# Altium schematic sheet UART.SchDoc
size A3; Author: Nguyễn Hữu Thắng; DrawnBy: Nguyễn Hữu Thắng; SheetNumber: 29; SheetTotal: 35
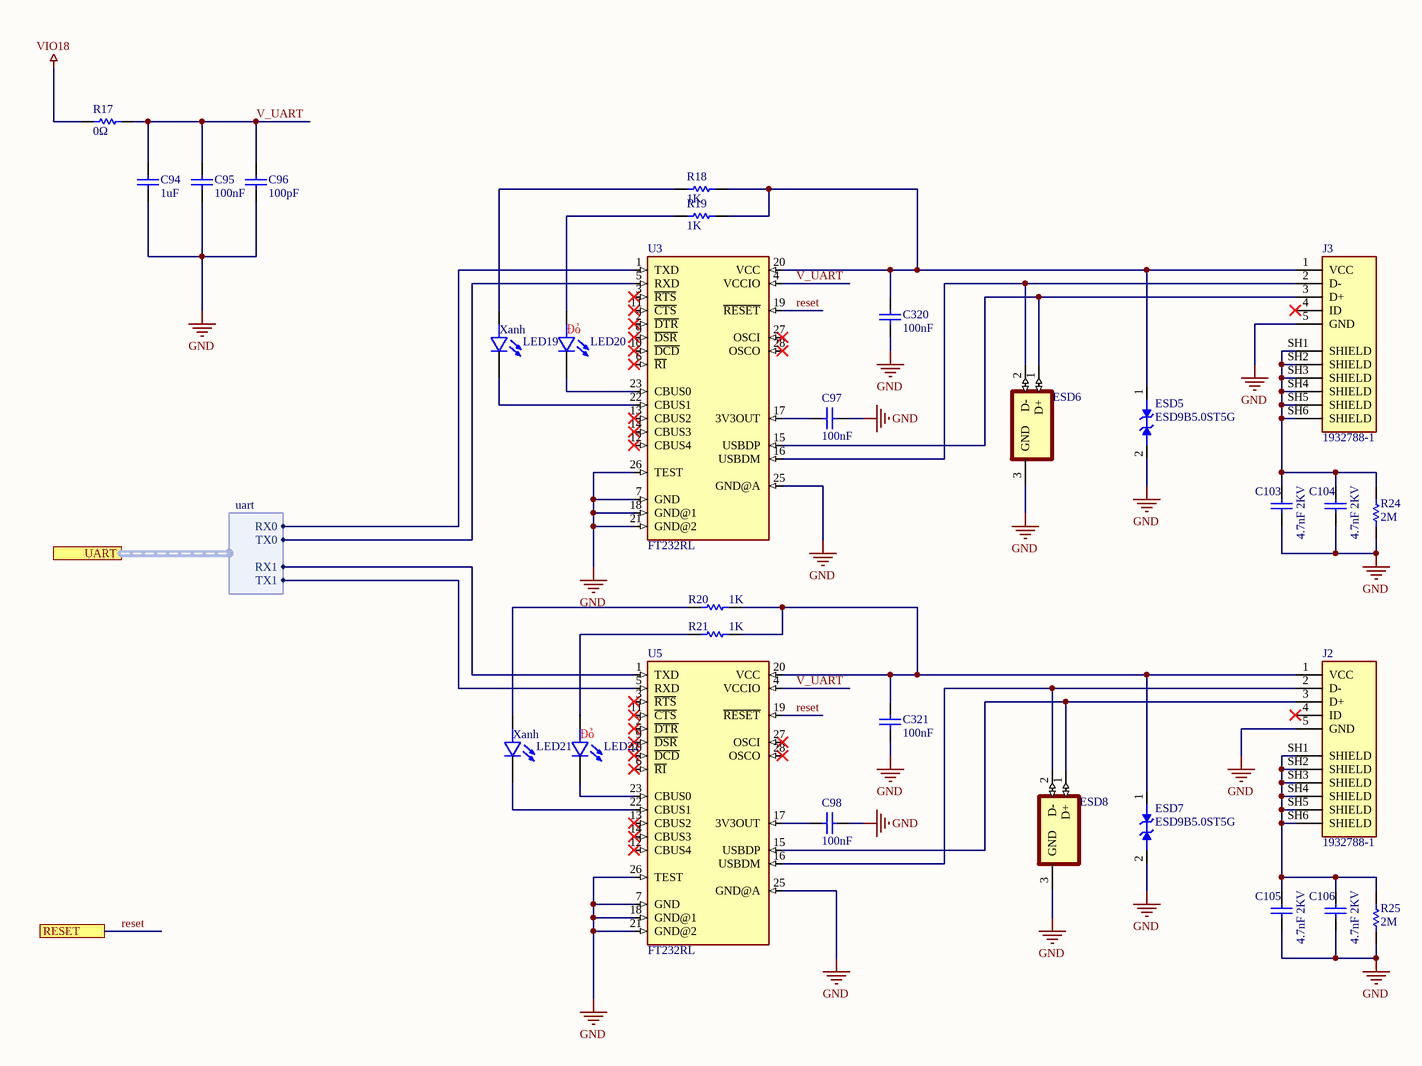
[diagram p0: UART.SchDoc]

## Parts
C94  value 1uF  [C0805]  (hidden comment: C0805)
C95  value 100nF  [C0603]  (hidden comment: C0603)
C96  value 100pF  [C0402]  (hidden comment: C0402)
C97  value 100nF  [C0603]  (hidden comment: C0603)
C98  value 100nF  [C0603]  (hidden comment: C0603)
C103  value 4.7nF 2KV  [C1210]  (hidden comment: C1210)
C104  value 4.7nF 2KV  [C1210]  (hidden comment: C1210)
C105  value 4.7nF 2KV  [C1210]  (hidden comment: C1210)
C106  value 4.7nF 2KV  [C1210]  (hidden comment: C1210)
C320  value 100nF  [C0603]  (hidden comment: C0603)
C321  value 100nF  [C0603]  (hidden comment: C0603)
ESD5  ESD9B5.0ST5G  [SODFL1006X40N]
ESD6  TPD2EUSB30DRTR  [SOTFL35P100X50-3N]  (value not drawn)
ESD7  ESD9B5.0ST5G  [SODFL1006X40N]
ESD8  TPD2EUSB30DRTR  [SOTFL35P100X50-3N]  (value not drawn)
J2  1932788-1  [TE_1932788-1]
J3  1932788-1  [TE_1932788-1]
LED19  LED0402  [LED0402]  (value not drawn)
LED20  LED0402  [LED0402]  (value not drawn)
LED21  LED0402  [LED0402]  (value not drawn)
LED22  LED0402  [LED0402]  (value not drawn)
R17  value 0Ω  [R0603]  (hidden comment: R0603)
R18  value 1K  [R0603]  (hidden comment: R0603)
R19  value 1K  [R0603]  (hidden comment: R0603)
R20  value 1K  [R0603]  (hidden comment: R0603)
R21  value 1K  [R0603]  (hidden comment: R0603)
R24  value 2M  [R0603]  (hidden comment: R0603)
R25  value 2M  [R0603]  (hidden comment: R0603)
U3  FT232RL  [FT232RL]
U5  FT232RL  [FT232RL]

## Ports
RESET (see main[9000,5800], Control_Interface[4100,4800], Power[11300,7100], RTL8201F[12800,5800]), UART (harness uart, see main[9000,5600], MT8365[6300,9000], MT8365_CONN[11800,6800])

## Harnesses
uart: TX0, RX0, TX1, RX1

## Nets
GND: C94.2 C95.1 C96.1 C97.1 C98.1 C103.1 C104.1 C105.1 C106.1 C320.1 C321.1 ESD5.2(A1) ESD6.3(GND) ESD7.2(A1) ESD8.3(GND) J2.5(GND) J3.5(GND) R24.2 R25.2 U3.7(GND) U3.18(GND@1) U3.21(GND@2) U3.25(GND@A) U3.26(TEST) U5.7(GND) U5.18(GND@1) U5.21(GND@2) U5.25(GND@A) U5.26(TEST)
VIO18: R17.1
reset: U3.19(~{RESET}) U5.19(~{RESET}) ; port RESET
V_UART: C94.1 C95.2 C96.2 R17.2 U3.4(VCCIO) U5.4(VCCIO)
NetC97_2: C97.2 U3.17(3V3OUT)
NetC98_2: C98.2 U5.17(3V3OUT)
NetC103_2: C103.2 C104.2 J3.SH1(SHIELD) J3.SH2(SHIELD) J3.SH3(SHIELD) J3.SH4(SHIELD) J3.SH5(SHIELD) J3.SH6(SHIELD) R24.1
NetC105_2: C105.2 C106.2 J2.SH1(SHIELD) J2.SH2(SHIELD) J2.SH3(SHIELD) J2.SH4(SHIELD) J2.SH5(SHIELD) J2.SH6(SHIELD) R25.1
NetC320_2: C320.2 ESD5.1(A) J3.1(VCC) R18.2 R19.2 U3.20(VCC)
NetC321_2: C321.2 ESD7.1(A) J2.1(VCC) R20.2 R21.2 U5.20(VCC)
NetESD6_1: ESD6.1(D+) J3.3(D+) U3.15(USBDP)
NetESD6_2: ESD6.2(D-) J3.2(D-) U3.16(USBDM)
NetESD8_1: ESD8.1(D+) J2.3(D+) U5.15(USBDP)
NetESD8_2: ESD8.2(D-) J2.2(D-) U5.16(USBDM)
NetLED19_A: LED19.A R18.1
NetLED19_C: LED19.C U3.22(CBUS1)
NetLED20_A: LED20.A R19.1
NetLED20_C: LED20.C U3.23(CBUS0)
NetLED21_A: LED21.A R20.1
NetLED21_C: LED21.C U5.22(CBUS1)
NetLED22_A: LED22.A R21.1
NetLED22_C: LED22.C U5.23(CBUS0)
NetU3_1: U3.1(TXD) ; port UART.RX0
NetU3_5: U3.5(RXD) ; port UART.TX0
NetU5_1: U5.1(TXD) ; port UART.RX1
NetU5_5: U5.5(RXD) ; port UART.TX1

Not connected (* = marked no-connect by the designer): J2 4(ID)*; J3 4(ID)*; U3 2(~{DTR})* 3(~{RTS})* 6(~{RI})* 9(~{DSR})* 10(~{DCD})* 11(~{CTS})* 12(CBUS4)* 13(CBUS2)* 14(CBUS3)* 27(OSCI)* 28(OSCO)*; U5 2(~{DTR})* 3(~{RTS})* 6(~{RI})* 9(~{DSR})* 10(~{DCD})* 11(~{CTS})* 12(CBUS4)* 13(CBUS2)* 14(CBUS3)* 27(OSCI)* 28(OSCO)*

## Notes on the sheet
- (near LED19) Xanh
- (near LED20) Đỏ
- (near LED21) Xanh
- (near LED22) Đỏ

## Library data of the parts
ESD5 ESD7 = ESD9B5.0ST5G: Clamp Ipp Tvs Diode Surface Mount SOD-923
ESD6 ESD8 = TPD2EUSB30DRTR: 2-channel ESD solution for SuperSpeed USB 3.0 interface 3-SOT-9X3 -40 to 85
LED19-LED22 = LED0402: LED SMD